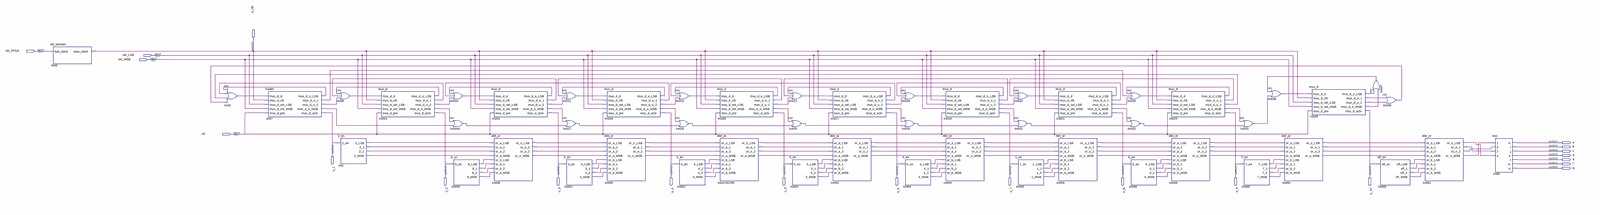
[diagram p0: schematic sheet, whole]
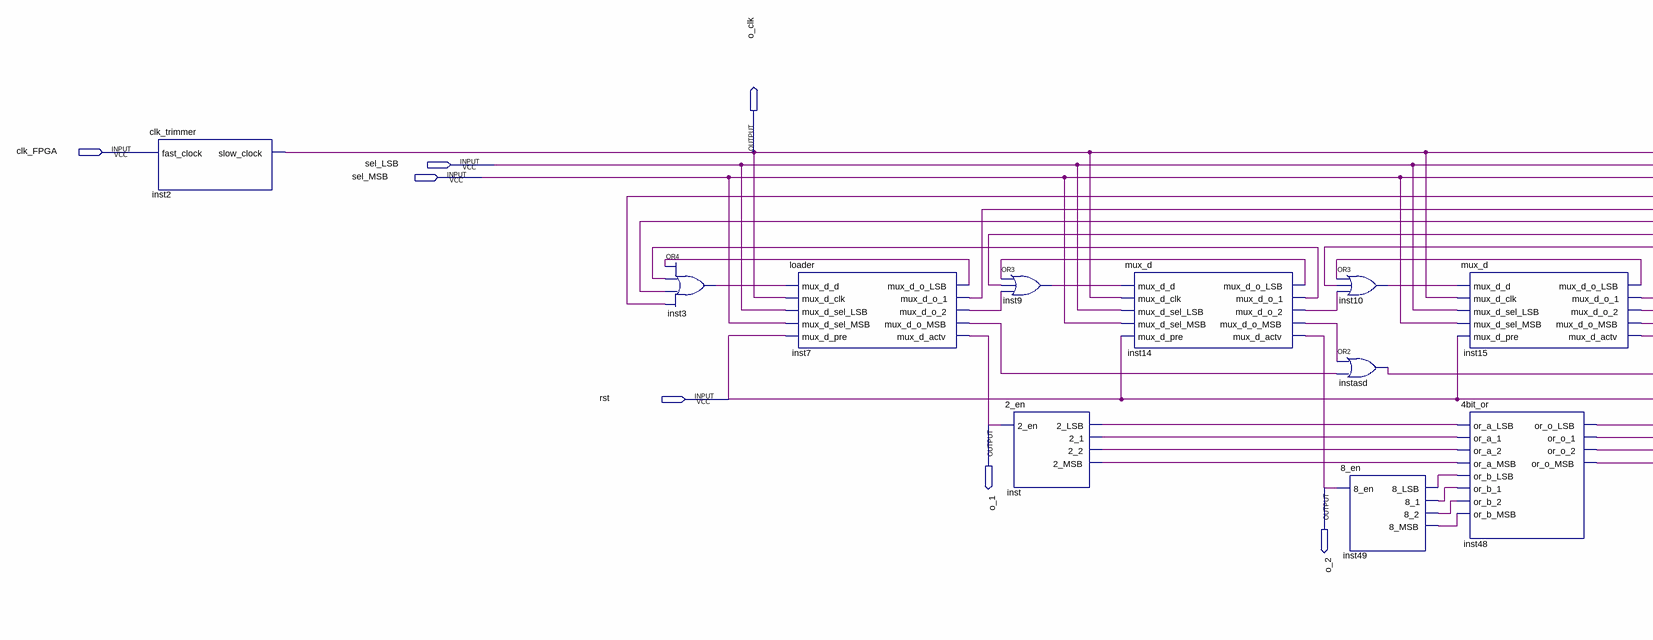
[diagram p1: schematic sheet, left part]
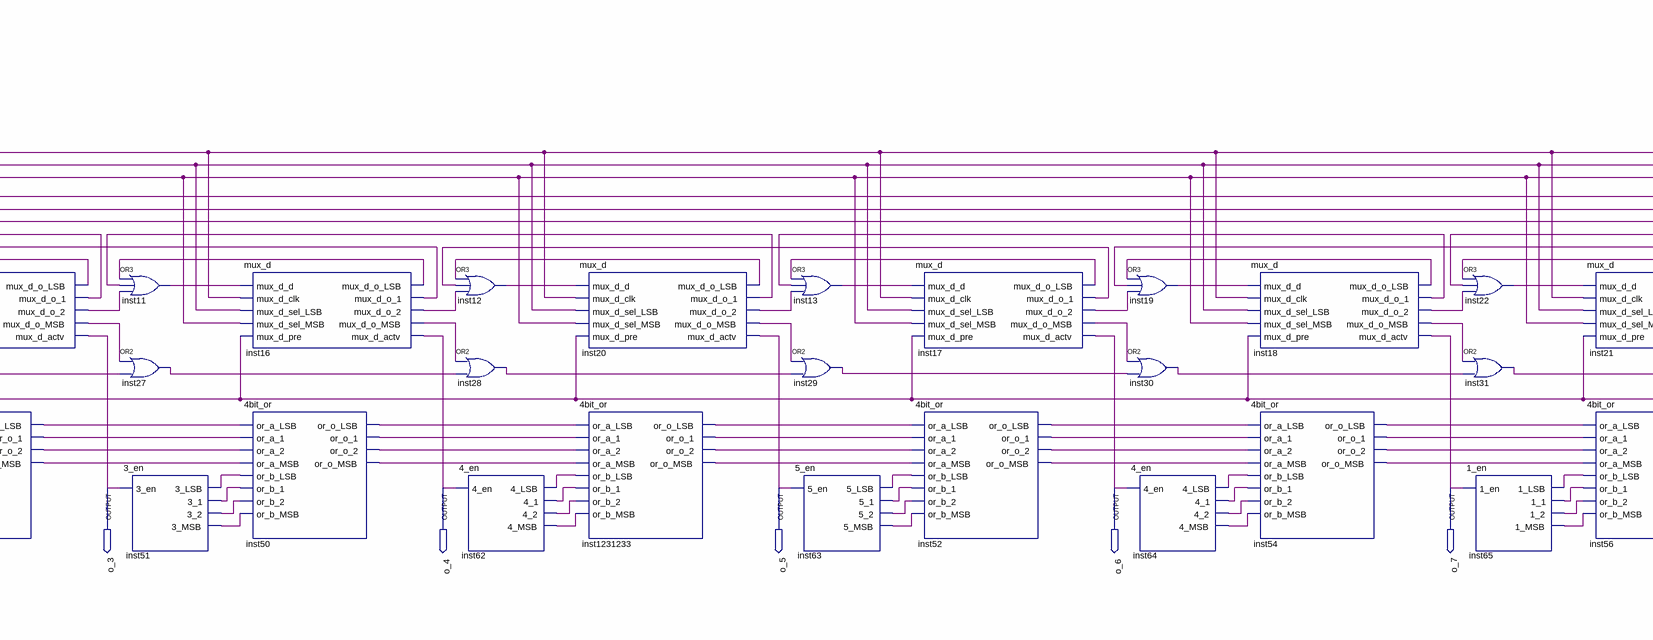
[diagram p2: schematic sheet, centre part]
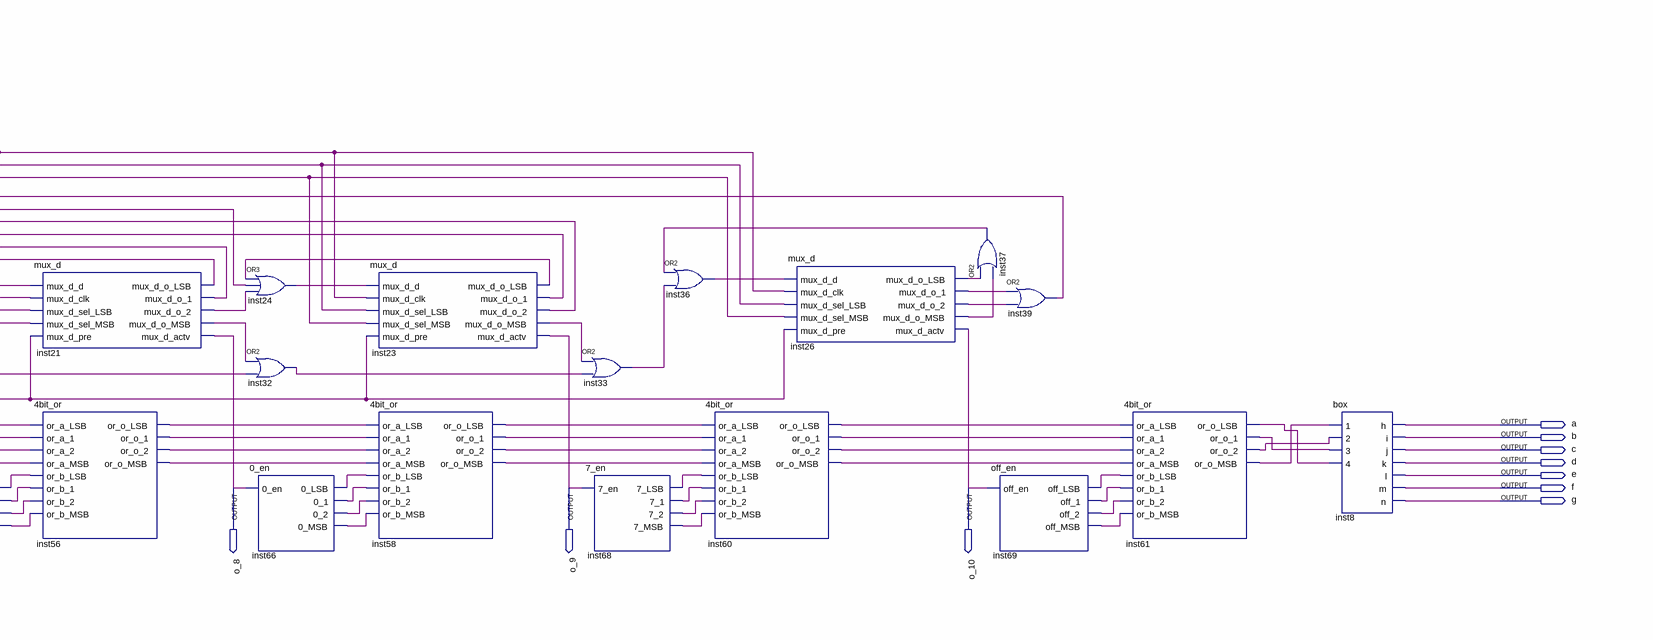
[diagram p3: schematic sheet, right part]
// Quartus schematic bcd.bdf as structural Verilog: 51 symbols, 22 pins
module bcd (
  input  clk_FPGA,
  input  sel_LSB,
  input  sel_MSB,
  input  rst,
  output o_clk,
  output o_1,
  output a,
  output b,
  output c,
  output d,
  output e,
  output o_2,
  output o_3,
  output o_4,
  output o_5,
  output o_6,
  output o_7,
  output o_8,
  output o_9,
  output o_10,
  output f,
  output g
);

  wire inst3_out, inst7_mux_d_o_1, inst7_mux_d_o_2, inst7_mux_d_o_lsb, inst7_mux_d_o_msb, inst9_out,
       inst10_out, inst11_out, inst12_out, inst13_out, inst14_mux_d_o_1, inst14_mux_d_o_2,
       inst14_mux_d_o_lsb, inst14_mux_d_o_msb, inst15_mux_d_o_1, inst15_mux_d_o_2, inst15_mux_d_o_lsb,
       inst15_mux_d_o_msb, inst16_mux_d_o_1, inst16_mux_d_o_2, inst16_mux_d_o_lsb, inst16_mux_d_o_msb,
       inst17_mux_d_o_1, inst17_mux_d_o_2, inst17_mux_d_o_lsb, inst17_mux_d_o_msb, inst18_mux_d_o_1,
       inst18_mux_d_o_2, inst18_mux_d_o_lsb, inst18_mux_d_o_msb, inst19_out, inst20_mux_d_o_1,
       inst20_mux_d_o_2, inst20_mux_d_o_lsb, inst20_mux_d_o_msb, inst21_mux_d_o_1, inst21_mux_d_o_2,
       inst21_mux_d_o_lsb, inst21_mux_d_o_msb, inst22_out, inst23_mux_d_o_1, inst23_mux_d_o_2,
       inst23_mux_d_o_lsb, inst23_mux_d_o_msb, inst24_out, inst26_mux_d_o_1, inst26_mux_d_o_2,
       inst26_mux_d_o_lsb, inst26_mux_d_o_msb, inst27_out, inst28_out, inst29_out, inst30_out, inst31_out,
       inst32_out, inst33_out, inst36_out, inst37_out, inst39_out, inst48_or_o_1, inst48_or_o_2,
       inst48_or_o_lsb, inst48_or_o_msb, inst49_8_1, inst49_8_2, inst49_8_lsb, inst49_8_msb, inst50_or_o_1,
       inst50_or_o_2, inst50_or_o_lsb, inst50_or_o_msb, inst51_3_1, inst51_3_2, inst51_3_lsb, inst51_3_msb,
       inst52_or_o_1, inst52_or_o_2, inst52_or_o_lsb, inst52_or_o_msb, inst54_or_o_1, inst54_or_o_2,
       inst54_or_o_lsb, inst54_or_o_msb, inst56_or_o_1, inst56_or_o_2, inst56_or_o_lsb, inst56_or_o_msb,
       inst58_or_o_1, inst58_or_o_2, inst58_or_o_lsb, inst58_or_o_msb, inst60_or_o_1, inst60_or_o_2,
       inst60_or_o_lsb, inst60_or_o_msb, inst61_or_o_1, inst61_or_o_2, inst61_or_o_lsb, inst61_or_o_msb,
       inst62_4_1, inst62_4_2, inst62_4_lsb, inst62_4_msb, inst63_5_1, inst63_5_2, inst63_5_lsb,
       inst63_5_msb, inst64_4_1, inst64_4_2, inst64_4_lsb, inst64_4_msb, inst65_1_1, inst65_1_2,
       inst65_1_lsb, inst65_1_msb, inst66_0_1, inst66_0_2, inst66_0_lsb, inst66_0_msb, inst68_7_1,
       inst68_7_2, inst68_7_lsb, inst68_7_msb, inst69_off_1, inst69_off_2, inst69_off_lsb, inst69_off_msb,
       inst1231233_or_o_1, inst1231233_or_o_2, inst1231233_or_o_lsb, inst1231233_or_o_msb, inst_2_1,
       inst_2_2, inst_2_lsb, inst_2_msb, instasd_out;

  clk_trimmer inst2 (.fast_clock(clk_FPGA), .slow_clock(o_clk));
  or inst3 (inst3_out, inst7_mux_d_o_lsb, inst14_mux_d_o_1, inst23_mux_d_o_2, inst39_out);
  loader inst7 (
    .mux_d_d(inst3_out), .mux_d_clk(o_clk), .mux_d_sel_LSB(sel_LSB), .mux_d_sel_MSB(sel_MSB),
    .mux_d_pre(rst), .mux_d_o_LSB(inst7_mux_d_o_lsb), .mux_d_o_1(inst7_mux_d_o_1),
    .mux_d_o_2(inst7_mux_d_o_2), .mux_d_o_MSB(inst7_mux_d_o_msb), .mux_d_actv(o_1));
  or inst9 (inst9_out, inst14_mux_d_o_lsb, inst15_mux_d_o_1, inst7_mux_d_o_2);
  \2_en  inst (.\2_en (o_1), .\2_LSB (inst_2_lsb), .\2_1 (inst_2_1), .\2_2 (inst_2_2), .\2_MSB (inst_2_msb));
  mux_d inst14 (
    .mux_d_d(inst9_out), .mux_d_clk(o_clk), .mux_d_sel_LSB(sel_LSB), .mux_d_sel_MSB(sel_MSB),
    .mux_d_pre(rst), .mux_d_o_LSB(inst14_mux_d_o_lsb), .mux_d_o_1(inst14_mux_d_o_1),
    .mux_d_o_2(inst14_mux_d_o_2), .mux_d_o_MSB(inst14_mux_d_o_msb), .mux_d_actv(o_2));
  or inst10 (inst10_out, inst15_mux_d_o_lsb, inst16_mux_d_o_1, inst14_mux_d_o_2);
  or instasd (instasd_out, inst14_mux_d_o_msb, inst7_mux_d_o_msb);
  \8_en  inst49 (.\8_en (o_2), .\8_LSB (inst49_8_lsb), .\8_1 (inst49_8_1), .\8_2 (inst49_8_2), .\8_MSB (inst49_8_msb));
  mux_d inst15 (
    .mux_d_d(inst10_out), .mux_d_clk(o_clk), .mux_d_sel_LSB(sel_LSB), .mux_d_sel_MSB(sel_MSB),
    .mux_d_pre(rst), .mux_d_o_LSB(inst15_mux_d_o_lsb), .mux_d_o_1(inst15_mux_d_o_1),
    .mux_d_o_2(inst15_mux_d_o_2), .mux_d_o_MSB(inst15_mux_d_o_msb), .mux_d_actv(o_3));
  \4bit_or  inst48 (
    .or_a_LSB(inst_2_lsb), .or_a_1(inst_2_1), .or_a_2(inst_2_2), .or_a_MSB(inst_2_msb),
    .or_b_LSB(inst49_8_lsb), .or_b_1(inst49_8_1), .or_b_2(inst49_8_2), .or_b_MSB(inst49_8_msb),
    .or_o_LSB(inst48_or_o_lsb), .or_o_1(inst48_or_o_1), .or_o_2(inst48_or_o_2), .or_o_MSB(inst48_or_o_msb));
  or inst11 (inst11_out, inst16_mux_d_o_lsb, inst20_mux_d_o_1, inst15_mux_d_o_2);
  or inst27 (inst27_out, inst15_mux_d_o_msb, instasd_out);
  \3_en  inst51 (.\3_en (o_3), .\3_LSB (inst51_3_lsb), .\3_1 (inst51_3_1), .\3_2 (inst51_3_2), .\3_MSB (inst51_3_msb));
  mux_d inst16 (
    .mux_d_d(inst11_out), .mux_d_clk(o_clk), .mux_d_sel_LSB(sel_LSB), .mux_d_sel_MSB(sel_MSB),
    .mux_d_pre(rst), .mux_d_o_LSB(inst16_mux_d_o_lsb), .mux_d_o_1(inst16_mux_d_o_1),
    .mux_d_o_2(inst16_mux_d_o_2), .mux_d_o_MSB(inst16_mux_d_o_msb), .mux_d_actv(o_4));
  \4bit_or  inst50 (
    .or_a_LSB(inst48_or_o_lsb), .or_a_1(inst48_or_o_1), .or_a_2(inst48_or_o_2), .or_a_MSB(inst48_or_o_msb),
    .or_b_LSB(inst51_3_lsb), .or_b_1(inst51_3_1), .or_b_2(inst51_3_2), .or_b_MSB(inst51_3_msb),
    .or_o_LSB(inst50_or_o_lsb), .or_o_1(inst50_or_o_1), .or_o_2(inst50_or_o_2), .or_o_MSB(inst50_or_o_msb));
  or inst12 (inst12_out, inst20_mux_d_o_lsb, inst17_mux_d_o_1, inst16_mux_d_o_2);
  or inst28 (inst28_out, inst16_mux_d_o_msb, inst27_out);
  \4_en  inst62 (.\4_en (o_4), .\4_LSB (inst62_4_lsb), .\4_1 (inst62_4_1), .\4_2 (inst62_4_2), .\4_MSB (inst62_4_msb));
  mux_d inst20 (
    .mux_d_d(inst12_out), .mux_d_clk(o_clk), .mux_d_sel_LSB(sel_LSB), .mux_d_sel_MSB(sel_MSB),
    .mux_d_pre(rst), .mux_d_o_LSB(inst20_mux_d_o_lsb), .mux_d_o_1(inst20_mux_d_o_1),
    .mux_d_o_2(inst20_mux_d_o_2), .mux_d_o_MSB(inst20_mux_d_o_msb), .mux_d_actv(o_5));
  \4bit_or  inst1231233 (
    .or_a_LSB(inst50_or_o_lsb), .or_a_1(inst50_or_o_1), .or_a_2(inst50_or_o_2), .or_a_MSB(inst50_or_o_msb),
    .or_b_LSB(inst62_4_lsb), .or_b_1(inst62_4_1), .or_b_2(inst62_4_2), .or_b_MSB(inst62_4_msb),
    .or_o_LSB(inst1231233_or_o_lsb), .or_o_1(inst1231233_or_o_1), .or_o_2(inst1231233_or_o_2),
    .or_o_MSB(inst1231233_or_o_msb));
  or inst13 (inst13_out, inst17_mux_d_o_lsb, inst18_mux_d_o_1, inst20_mux_d_o_2);
  or inst29 (inst29_out, inst20_mux_d_o_msb, inst28_out);
  \5_en  inst63 (.\5_en (o_5), .\5_LSB (inst63_5_lsb), .\5_1 (inst63_5_1), .\5_2 (inst63_5_2), .\5_MSB (inst63_5_msb));
  mux_d inst17 (
    .mux_d_d(inst13_out), .mux_d_clk(o_clk), .mux_d_sel_LSB(sel_LSB), .mux_d_sel_MSB(sel_MSB),
    .mux_d_pre(rst), .mux_d_o_LSB(inst17_mux_d_o_lsb), .mux_d_o_1(inst17_mux_d_o_1),
    .mux_d_o_2(inst17_mux_d_o_2), .mux_d_o_MSB(inst17_mux_d_o_msb), .mux_d_actv(o_6));
  \4bit_or  inst52 (
    .or_a_LSB(inst1231233_or_o_lsb), .or_a_1(inst1231233_or_o_1), .or_a_2(inst1231233_or_o_2),
    .or_a_MSB(inst1231233_or_o_msb), .or_b_LSB(inst63_5_lsb), .or_b_1(inst63_5_1), .or_b_2(inst63_5_2),
    .or_b_MSB(inst63_5_msb), .or_o_LSB(inst52_or_o_lsb), .or_o_1(inst52_or_o_1), .or_o_2(inst52_or_o_2),
    .or_o_MSB(inst52_or_o_msb));
  or inst19 (inst19_out, inst18_mux_d_o_lsb, inst21_mux_d_o_1, inst17_mux_d_o_2);
  or inst30 (inst30_out, inst17_mux_d_o_msb, inst29_out);
  \4_en  inst64 (.\4_en (o_6), .\4_LSB (inst64_4_lsb), .\4_1 (inst64_4_1), .\4_2 (inst64_4_2), .\4_MSB (inst64_4_msb));
  mux_d inst18 (
    .mux_d_d(inst19_out), .mux_d_clk(o_clk), .mux_d_sel_LSB(sel_LSB), .mux_d_sel_MSB(sel_MSB),
    .mux_d_pre(rst), .mux_d_o_LSB(inst18_mux_d_o_lsb), .mux_d_o_1(inst18_mux_d_o_1),
    .mux_d_o_2(inst18_mux_d_o_2), .mux_d_o_MSB(inst18_mux_d_o_msb), .mux_d_actv(o_7));
  \4bit_or  inst54 (
    .or_a_LSB(inst52_or_o_lsb), .or_a_1(inst52_or_o_1), .or_a_2(inst52_or_o_2), .or_a_MSB(inst52_or_o_msb),
    .or_b_LSB(inst64_4_lsb), .or_b_1(inst64_4_1), .or_b_2(inst64_4_2), .or_b_MSB(inst64_4_msb),
    .or_o_LSB(inst54_or_o_lsb), .or_o_1(inst54_or_o_1), .or_o_2(inst54_or_o_2), .or_o_MSB(inst54_or_o_msb));
  or inst22 (inst22_out, inst21_mux_d_o_lsb, inst23_mux_d_o_1, inst18_mux_d_o_2);
  or inst31 (inst31_out, inst18_mux_d_o_msb, inst30_out);
  \1_en  inst65 (.\1_en (o_7), .\1_LSB (inst65_1_lsb), .\1_1 (inst65_1_1), .\1_2 (inst65_1_2), .\1_MSB (inst65_1_msb));
  mux_d inst21 (
    .mux_d_d(inst22_out), .mux_d_clk(o_clk), .mux_d_sel_LSB(sel_LSB), .mux_d_sel_MSB(sel_MSB),
    .mux_d_pre(rst), .mux_d_o_LSB(inst21_mux_d_o_lsb), .mux_d_o_1(inst21_mux_d_o_1),
    .mux_d_o_2(inst21_mux_d_o_2), .mux_d_o_MSB(inst21_mux_d_o_msb), .mux_d_actv(o_8));
  \4bit_or  inst56 (
    .or_a_LSB(inst54_or_o_lsb), .or_a_1(inst54_or_o_1), .or_a_2(inst54_or_o_2), .or_a_MSB(inst54_or_o_msb),
    .or_b_LSB(inst65_1_lsb), .or_b_1(inst65_1_1), .or_b_2(inst65_1_2), .or_b_MSB(inst65_1_msb),
    .or_o_LSB(inst56_or_o_lsb), .or_o_1(inst56_or_o_1), .or_o_2(inst56_or_o_2), .or_o_MSB(inst56_or_o_msb));
  or inst24 (inst24_out, inst23_mux_d_o_lsb, inst7_mux_d_o_1, inst21_mux_d_o_2);
  or inst32 (inst32_out, inst21_mux_d_o_msb, inst31_out);
  \0_en  inst66 (.\0_en (o_8), .\0_LSB (inst66_0_lsb), .\0_1 (inst66_0_1), .\0_2 (inst66_0_2), .\0_MSB (inst66_0_msb));
  mux_d inst23 (
    .mux_d_d(inst24_out), .mux_d_clk(o_clk), .mux_d_sel_LSB(sel_LSB), .mux_d_sel_MSB(sel_MSB),
    .mux_d_pre(rst), .mux_d_o_LSB(inst23_mux_d_o_lsb), .mux_d_o_1(inst23_mux_d_o_1),
    .mux_d_o_2(inst23_mux_d_o_2), .mux_d_o_MSB(inst23_mux_d_o_msb), .mux_d_actv(o_9));
  \4bit_or  inst58 (
    .or_a_LSB(inst56_or_o_lsb), .or_a_1(inst56_or_o_1), .or_a_2(inst56_or_o_2), .or_a_MSB(inst56_or_o_msb),
    .or_b_LSB(inst66_0_lsb), .or_b_1(inst66_0_1), .or_b_2(inst66_0_2), .or_b_MSB(inst66_0_msb),
    .or_o_LSB(inst58_or_o_lsb), .or_o_1(inst58_or_o_1), .or_o_2(inst58_or_o_2), .or_o_MSB(inst58_or_o_msb));
  or inst33 (inst33_out, inst23_mux_d_o_msb, inst32_out);
  \7_en  inst68 (.\7_en (o_9), .\7_LSB (inst68_7_lsb), .\7_1 (inst68_7_1), .\7_2 (inst68_7_2), .\7_MSB (inst68_7_msb));
  or inst36 (inst36_out, inst37_out, inst33_out);
  \4bit_or  inst60 (
    .or_a_LSB(inst58_or_o_lsb), .or_a_1(inst58_or_o_1), .or_a_2(inst58_or_o_2), .or_a_MSB(inst58_or_o_msb),
    .or_b_LSB(inst68_7_lsb), .or_b_1(inst68_7_1), .or_b_2(inst68_7_2), .or_b_MSB(inst68_7_msb),
    .or_o_LSB(inst60_or_o_lsb), .or_o_1(inst60_or_o_1), .or_o_2(inst60_or_o_2), .or_o_MSB(inst60_or_o_msb));
  mux_d inst26 (
    .mux_d_d(inst36_out), .mux_d_clk(o_clk), .mux_d_sel_LSB(sel_LSB), .mux_d_sel_MSB(sel_MSB),
    .mux_d_pre(rst), .mux_d_o_LSB(inst26_mux_d_o_lsb), .mux_d_o_1(inst26_mux_d_o_1),
    .mux_d_o_2(inst26_mux_d_o_2), .mux_d_o_MSB(inst26_mux_d_o_msb), .mux_d_actv(o_10));
  or inst37 (inst37_out, inst26_mux_d_o_lsb, inst26_mux_d_o_msb);
  or inst39 (inst39_out, inst26_mux_d_o_1, inst26_mux_d_o_2);
  off_en inst69 (
    .off_en(o_10), .off_LSB(inst69_off_lsb), .off_1(inst69_off_1), .off_2(inst69_off_2),
    .off_MSB(inst69_off_msb));
  \4bit_or  inst61 (
    .or_a_LSB(inst60_or_o_lsb), .or_a_1(inst60_or_o_1), .or_a_2(inst60_or_o_2), .or_a_MSB(inst60_or_o_msb),
    .or_b_LSB(inst69_off_lsb), .or_b_1(inst69_off_1), .or_b_2(inst69_off_2), .or_b_MSB(inst69_off_msb),
    .or_o_LSB(inst61_or_o_lsb), .or_o_1(inst61_or_o_1), .or_o_2(inst61_or_o_2), .or_o_MSB(inst61_or_o_msb));
  box inst8 (
    .\1 (inst61_or_o_msb), .\2 (inst61_or_o_2), .\3 (inst61_or_o_1), .\4 (inst61_or_o_lsb), .h(a), .i(b),
    .j(c), .k(d), .l(e), .m(f), .n(g));
endmodule
